# Altium schematic sheet Headers.SchDoc
size A; SheetNumber: 6; SheetTotal: 7
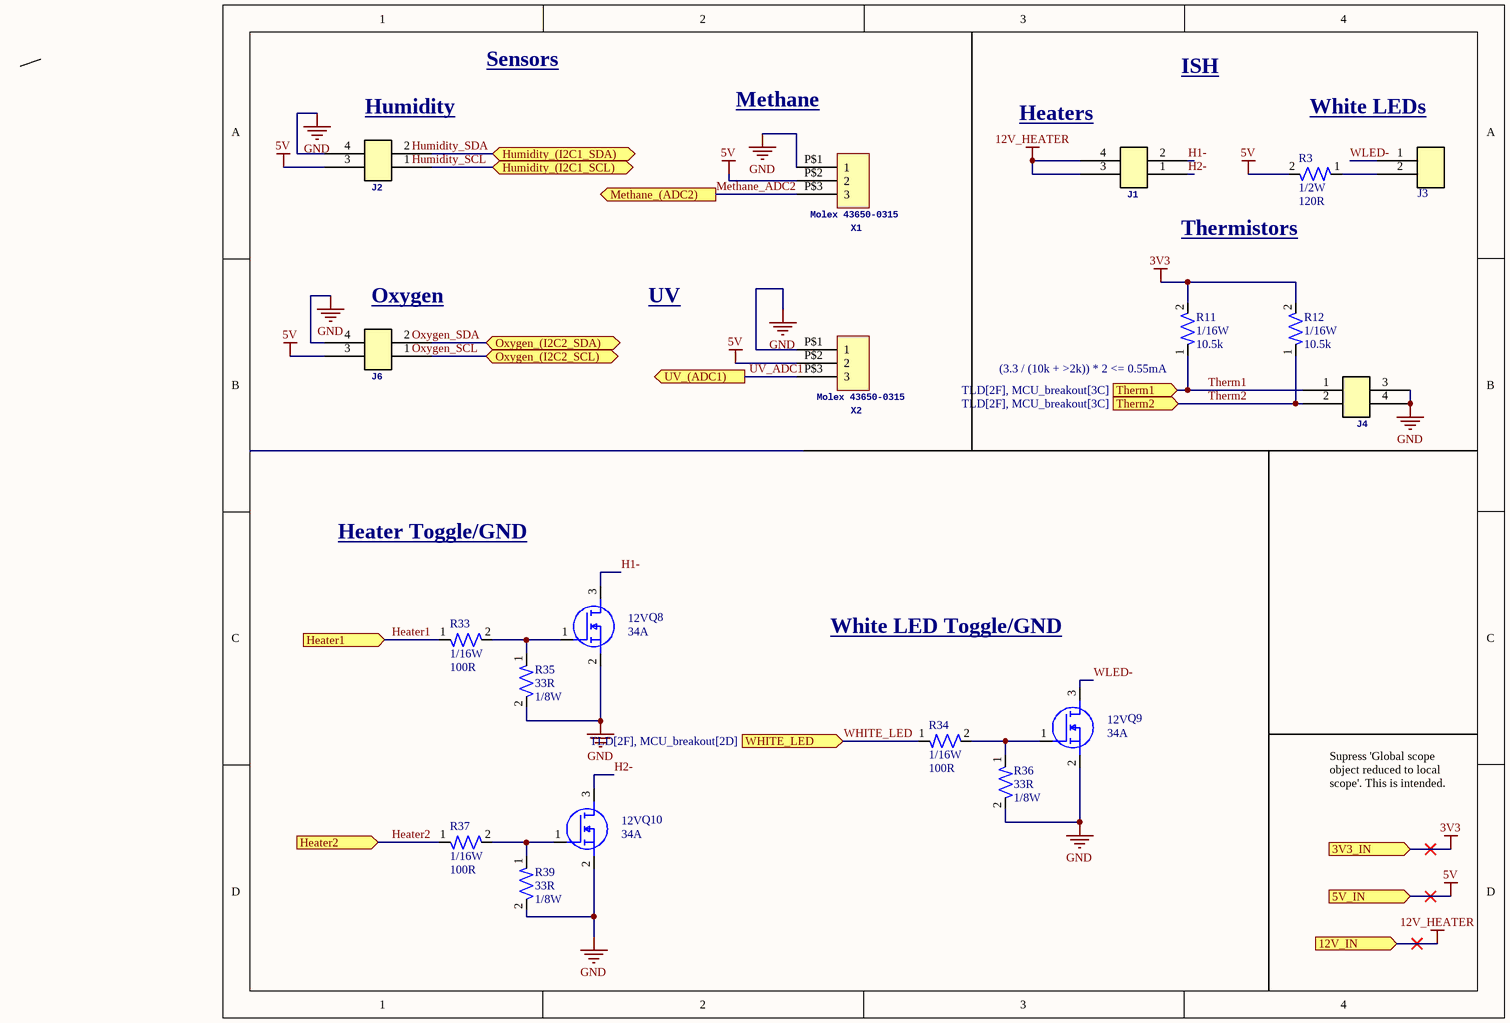
[diagram p0: Headers.SchDoc]

## Parts
J1  Molex 43045-0412  [CONN-4POS-0002]  (value not drawn)
J2  Molex 43045-0412  [CONN-4POS-0002]  (value not drawn)
J3  0430450212  [CONN-2POS-0001]  (value not drawn)
J4  Molex 43045-0412  [CONN-4POS-0002]  (value not drawn)
J6  Molex 43045-0412  [CONN-4POS-0002]  (value not drawn)
Q8  SI4838BDY-T1-GE3  [SOIC8_NARROW_VIS]  (value not drawn)
Q9  SI4838BDY-T1-GE3  [SOIC8_NARROW_VIS]  (value not drawn)
Q10  SI4838BDY-T1-GE3  [SOIC8_NARROW_VIS]  (value not drawn)
R3  Power: 1/2W  Resistance: 120R  [RES-1210]  (hidden comment: RC1210FR-07120RL)
R11  Power: 1/16W  Resistance: 10.5k  [RES-0402]  (hidden comment: RC0402FR-0710K5L)
R12  Power: 1/16W  Resistance: 10.5k  [RES-0402]  (hidden comment: RC0402FR-0710K5L)
R33  Power: 1/16W  Resistance: 100R  [RES-0402]  (hidden comment: RC0402FR-07100RL)
R34  Power: 1/16W  Resistance: 100R  [RES-0402]  (hidden comment: RC0402FR-07100RL)
R35  Resistance: 33R  Power: 1/8W  [RES-0402]  (hidden comment: RC0402FR-7W33RL)
R36  Resistance: 33R  Power: 1/8W  [RES-0402]  (hidden comment: RC0402FR-7W33RL)
R37  Power: 1/16W  Resistance: 100R  [RES-0402]  (hidden comment: RC0402FR-07100RL)
R39  Resistance: 33R  Power: 1/8W  [RES-0402]  (hidden comment: RC0402FR-7W33RL)
X1  Molex 43650-0315  [43650-0315]
X2  Molex 43650-0315  [43650-0315]

## Ports
3V3_IN (in), 5V_IN (in), 12V_IN (in), Heater1 (in, see TLD[3G], MCU_breakout[1C]), Heater2 (in, see TLD[3G], MCU_breakout[1C]), Humidity_(I2C1_SCL) (bidir, see TLD[2G]), Humidity_(I2C1_SDA) (bidir, see TLD[2G]), Methane_(ADC2) (out, see TLD[2G]), Oxygen_(I2C2_SCL) (bidir, see TLD[2F]), Oxygen_(I2C2_SDA) (bidir, see TLD[2F]), Therm1 (in, see TLD[2F], MCU_breakout[3C]), Therm2 (in, see TLD[2F], MCU_breakout[3C]), UV_(ADC1) (out, see TLD[2F]), WHITE_LED (in, see TLD[2F], MCU_breakout[2D])

## Nets
3V3: R11.2 R12.2 ; port 3V3_IN
5V: J2.3 J6.3 R3.2 X1.P$2(2) X2.P$2(2) ; port 5V_IN
12V_HEATER: J1.3 J1.4 ; port 12V_IN
GND: J2.4 J4.3 J4.4 J6.4 Q8.2(S) Q9.2(S) Q10.2(S) R35.2 R36.2 R39.2 X1.P$1(1) X2.P$1(1)
H1-: J1.2 Q8.3(D)
H2-: J1.1 Q10.3(D)
Heater1: R33.1 ; port Heater1
Heater2: R37.1 ; port Heater2
Humidity_(I2C1_SCL): J2.1 ; port Humidity_(I2C1_SCL)
Humidity_(I2C1_SDA): J2.2 ; port Humidity_(I2C1_SDA)
Methane_ADC2: X1.P$3(3) ; port Methane_(ADC2)
Oxygen_(I2C2_SCL): J6.1 ; port Oxygen_(I2C2_SCL)
Oxygen_(I2C2_SDA): J6.2 ; port Oxygen_(I2C2_SDA)
Therm1: J4.1 R11.1 ; port Therm1
Therm2: J4.2 R12.1 ; port Therm2
UV_ADC1: X2.P$3(3) ; port UV_(ADC1)
WHITE_LED: R34.1 ; port WHITE_LED
WLED-: J3.1 Q9.3(D)
NetJ3_2: J3.2 R3.1
NetQ8_1: Q8.1(G) R33.2 R35.1
NetQ9_1: Q9.1(G) R34.2 R36.1
NetQ10_1: Q10.1(G) R37.2 R39.1

## Notes on the sheet
- Sensors
- ISH
- (near J2) Humidity
- Methane
- (near J1) Heaters
- White LEDs
- Thermistors
- (near J6) Oxygen
- UV
- (near R11) (3.3 / (10k + >2k)) * 2 <= 0.55mA
- Heater Toggle/GND
- White LED Toggle/GND
- Supress 'Global scope object reduced to local scope'. This is intended.
- Labels drawn without touching a wire or pin: Humidity_SCL, Humidity_SDA, Oxygen_SCL, Oxygen_SDA
- (in symbol NMOS-34A-0001) 12V; 34A

## Library data of the parts
J1 J2 J4 J6 = CONN-4POS-0002: CONN HEADER VERT 4POS 3MM; ComponentLink1Description: Datasheet; ComponentLink1URL: https://www.molex.com/content/dam/molex/molex-dot-com/products/automated/en-us/salesdrawingpdf/430/43045/430450412_sd.pdf?inline
J3 = CONN-2POS-0001: CONN HEADER VERT 2POS; ComponentLink1Description: Datasheet; ComponentLink1URL: https://tools.molex.com/pdm_docs/ps/PS-43045.pdf
Q8-Q10 = NMOS-34A-0001: MOSFET N-CH 12 V 34A (Tc) 2.5W (Ta), 5.7W (Tc) Surface Mount 8-SOIC; Mfr_Name: Vishay; RefDes: RefDes; Type: Type
R3 = RES-120-0001: RES 120 OHM 1% 1/2W 1210; Tolerance: 1%; Size: 1210; ComponentLink1Description: Datasheet; ComponentLink1URL: https://www.yageo.com/upload/media/product/products/datasheet/rchip/PYu-RC_Group_51_RoHS_L_12.pdf
R11 R12 = RES-10.5k-0001: RES 10.5K OHM 1% 1/16W 0402; Tolerance: 1%; Size: 0402; ComponentLink1Description: Datasheet; ComponentLink1URL: https://www.yageo.com/upload/media/product/products/datasheet/rchip/PYu-RC_Group_51_RoHS_L_12.pdf
R33 R34 R37 = RES-100-0001: RES 100 OHM 1% 1/16W 0402; Tolerance: 1%; Size: 0402; ComponentLink1Description: Datasheet; ComponentLink1URL: https://www.yageo.com/upload/media/product/products/datasheet/rchip/PYu-RC_Group_51_RoHS_L_12.pdf
R35 R36 R39 = RES-33-0001: RES 33 OHM 1% 1/8W 0402; Tolerance: 1%; Size: 0402; ComponentLink1Description: Datasheet; ComponentLink1URL: https://www.yageo.com/upload/media/product/products/datasheet/rchip/PYu-RC_Group_51_RoHS_L_12.pdf
X1 X2 = Micro-Fit Molex 3 Pin Vertical: GateName_1: G$1; SymbolName_1: HEADER_POS3; DeviceSetName: HEADER_POS3_?; DeviceName: 43650-0315; LibraryName: con-molex-micro-fit-3_0_2; Package: 43650-0315